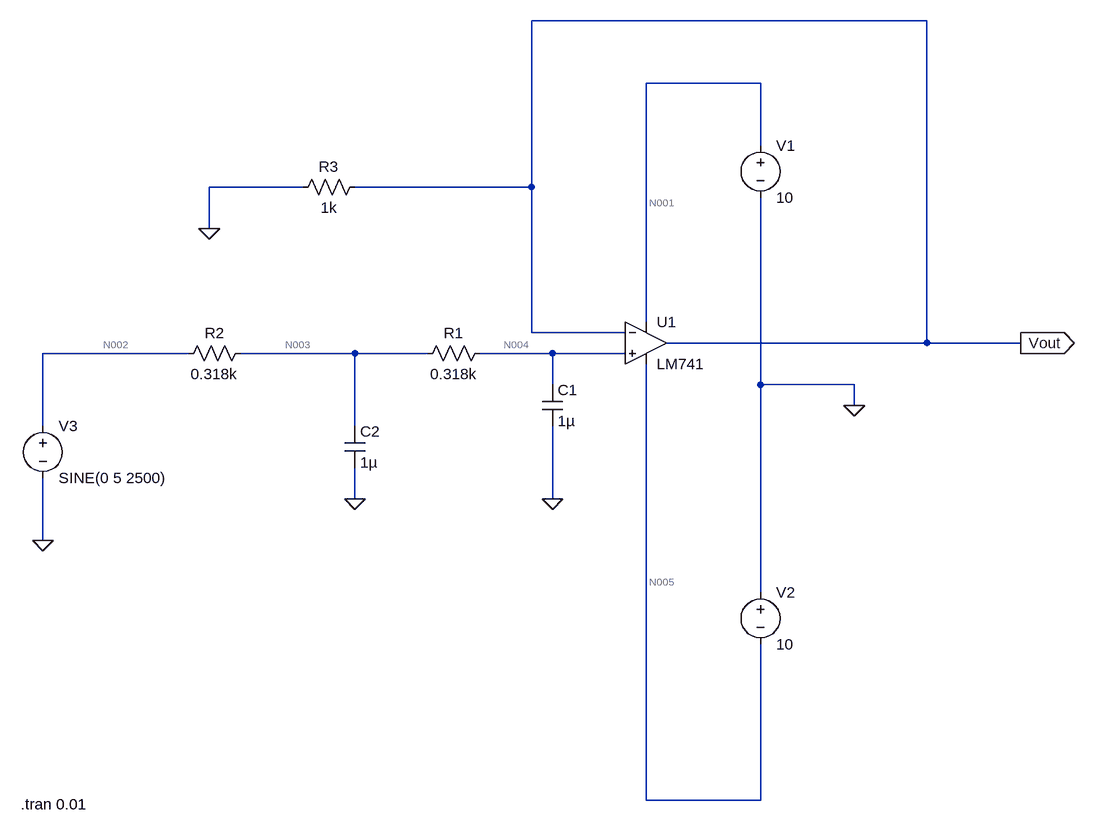
[diagram p0: schematic Draft2.asc]
Draft2.asc, the LTspice schematic file:
Version 4
SHEET 1 912 936
WIRE 656 -288 48 -288
WIRE 400 -192 224 -192
WIRE 400 -96 400 -192
WIRE -304 -32 -448 -32
WIRE 48 -32 48 -288
WIRE 48 -32 -224 -32
WIRE -448 32 -448 -32
WIRE 224 176 224 -192
WIRE 48 192 48 -32
WIRE 192 192 48 192
WIRE 656 208 656 -288
WIRE 656 208 256 208
WIRE 800 208 656 208
WIRE -480 224 -704 224
WIRE -224 224 -400 224
WIRE -112 224 -224 224
WIRE 80 224 -32 224
WIRE 192 224 80 224
WIRE 80 272 80 224
WIRE 400 272 400 -16
WIRE 544 272 400 272
WIRE 544 304 544 272
WIRE -704 336 -704 224
WIRE -224 336 -224 224
WIRE -224 448 -224 400
WIRE 80 448 80 336
WIRE -704 512 -704 416
WIRE 400 592 400 272
WIRE 224 912 224 240
WIRE 400 912 400 672
WIRE 400 912 224 912
FLAG 544 304 0
FLAG 800 208 Vout
IOPIN 800 208 Out
FLAG 80 448 0
FLAG -224 448 0
FLAG -448 32 0
FLAG -704 512 0
SYMBOL OpAmps\\LM741 224 144 R0
SYMATTR InstName U1
SYMBOL voltage 400 -112 R0
WINDOW 123 0 0 Left 0
WINDOW 39 0 0 Left 0
SYMATTR InstName V1
SYMATTR Value 10
SYMBOL voltage 400 576 R0
WINDOW 123 0 0 Left 0
WINDOW 39 0 0 Left 0
SYMATTR InstName V2
SYMATTR Value 10
SYMBOL cap 64 272 R0
SYMATTR InstName C1
SYMATTR Value 1µ
SYMBOL res -16 208 R90
WINDOW 0 0 56 VBottom 2
WINDOW 3 32 56 VTop 2
SYMATTR InstName R1
SYMATTR Value 0.318k
SYMBOL cap -240 336 R0
SYMATTR InstName C2
SYMATTR Value 1µ
SYMBOL res -384 208 R90
WINDOW 0 0 56 VBottom 2
WINDOW 3 32 56 VTop 2
SYMATTR InstName R2
SYMATTR Value 0.318k
SYMBOL res -208 -48 R90
WINDOW 0 0 56 VBottom 2
WINDOW 3 32 56 VTop 2
SYMATTR InstName R3
SYMATTR Value 1k
SYMBOL voltage -704 320 R0
WINDOW 123 0 0 Left 0
WINDOW 39 0 0 Left 0
SYMATTR InstName V3
SYMATTR Value SINE(0 5 2500)
TEXT -738 918 Left 2 !.tran 0.01

The netlist it stands for:
* Draft2.asc
XU1 N004 Vout N001 N005 Vout LM741  ; pins In+ In- V+ V- OUT
V1 N001 0 10
V2 0 N005 10
C1 N004 0 1µ
R1 N004 N003 0.318k
C2 N003 0 1µ
R2 N003 N002 0.318k
R3 Vout 0 1k
V3 N002 0 SINE(0 5 2500)
.tran 0.01
.lib LM741.lib
.backanno
.end

* Results of the author's LTspice run, read from the files saved beside the schematic
* Operating Point, zero values left out:
*   V(vout) = 963.2 µV
*   V(n004) = -36.8 µV
*   V(n005) = -10 V
*   V(n001) = 10 V
*   V(n003) = -18.4 µV
*   I(R3) = 963.2 nA
*   I(R2) = -57.86 nA
*   I(R1) = -57.86 nA
*   I(V3) = -57.86 nA
*   I(V2) = -1.576 mA
*   I(V1) = -1.577 mA
*   Ix(u1:1) = 57.86 nA
*   Ix(u1:2) = 101.9 nA
*   Ix(u1:99) = 1.577 mA
*   Ix(u1:50) = -1.576 mA
*   Ix(u1:28) = -1.065 µA
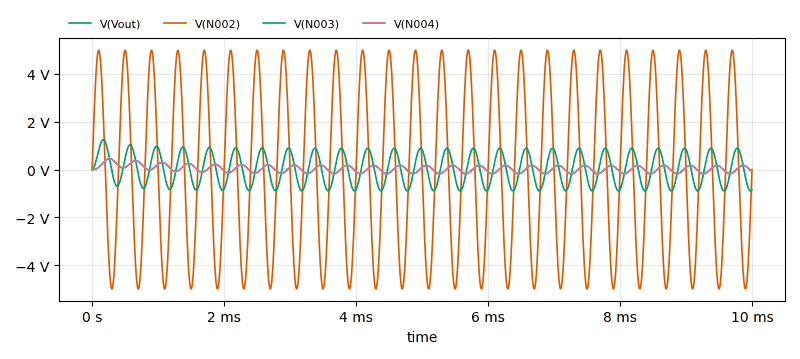
[diagram p1: Transient Analysis of Draft2.asc, plotted from the saved traces]
* Transient Analysis, 1 run:
*   V(Vout): min -173.9 mV, max 459.7 mV, average 33.69 mV, rms 144.7 mV, last -92.06 mV
*   V(N002): min -4.989 V, max 4.989 V, average 6.254 µV, rms 3.536 V, last 0 V
*   V(N003): min -892.6 mV, max 1.254 V, average 29.73 mV, rms 639.5 mV, last -842.2 mV
*   V(N004): min -174.9 mV, max 458.7 mV, average 32.69 mV, rms 144.4 mV, last -93.46 mV